# Altium schematic sheet DDR3 - IO.SchDoc
size A3; DocumentNumber: 12; SheetNumber: 12; SheetTotal: 17
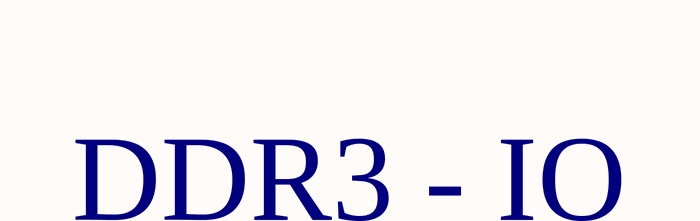
[diagram p0: DDR3 - IO.SchDoc]

## Notes on the sheet
- DDR3 - IO